# Altium schematic sheet Sheet_WallSwitch_TOP.SchDoc: Smart IoT Wallswitch
size A4; DrawnBy: Bc. Miroslav Kažimír; DocumentNumber: Wallswitch Top Module; SheetNumber: 1; SheetTotal: 1
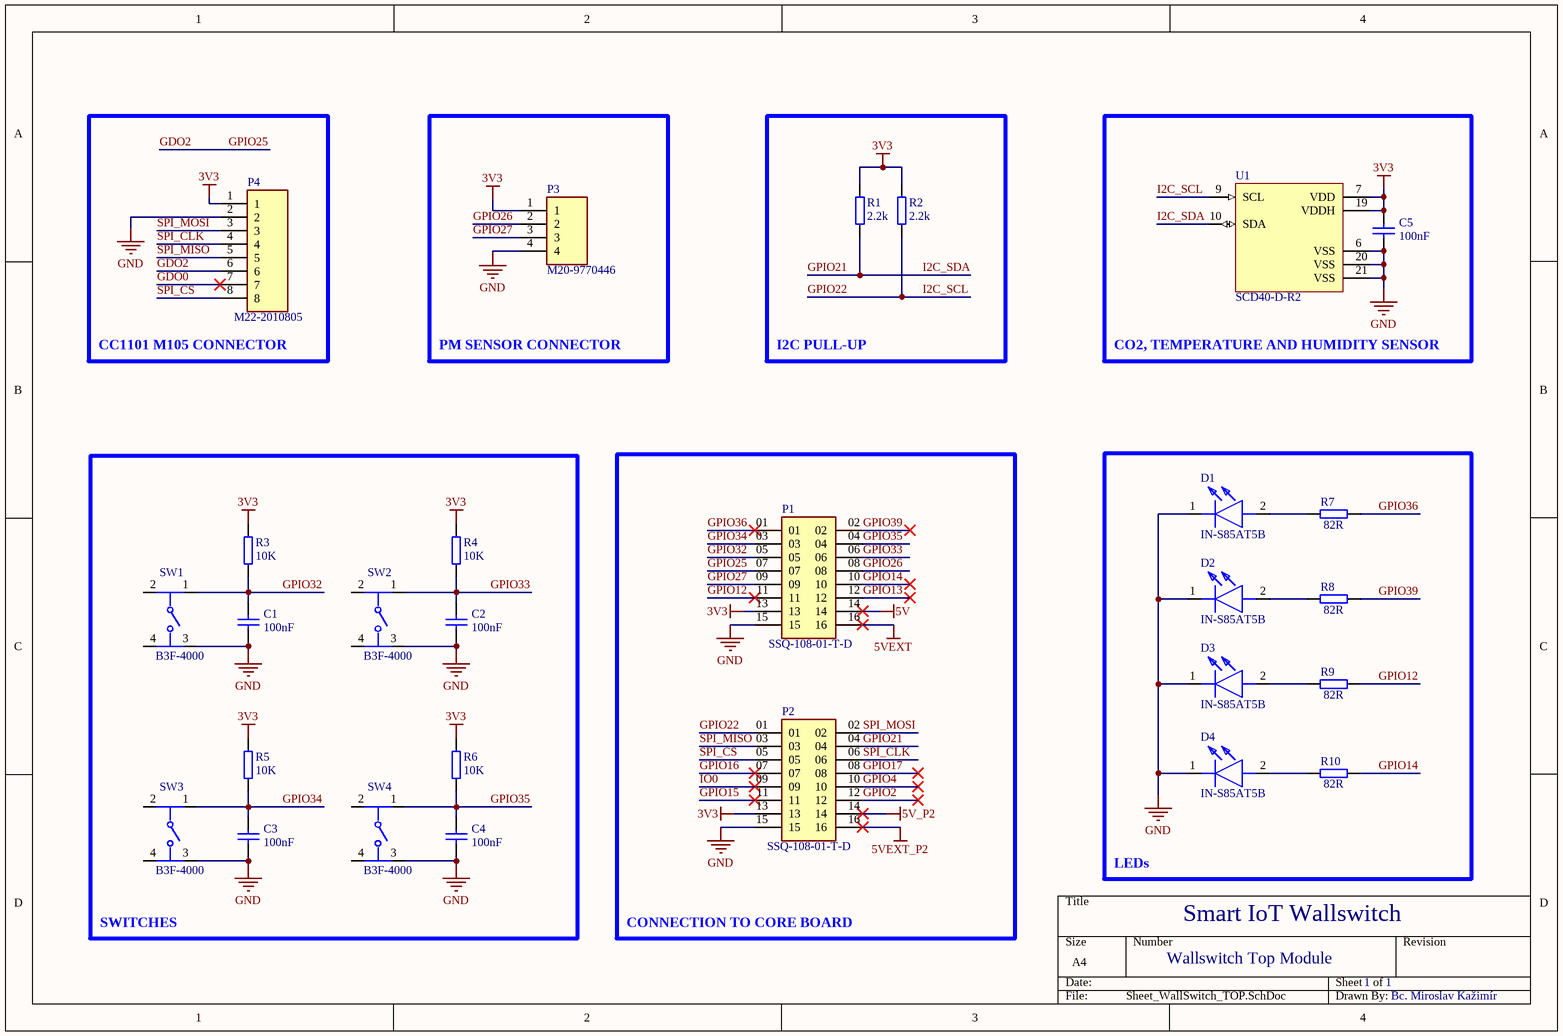
[diagram p0: Sheet_WallSwitch_TOP.SchDoc]

## Parts
C1  Capacitance: 100nF  [FP-C0805C-DN-IPC_A]  (hidden comment: C0805C104K5RAC7411)
C2  Capacitance: 100nF  [FP-C0805C-DN-IPC_A]  (hidden comment: C0805C104K5RAC7411)
C3  Capacitance: 100nF  [FP-C0805C-DN-IPC_A]  (hidden comment: C0805C104K5RAC7411)
C4  Capacitance: 100nF  [FP-C0805C-DN-IPC_A]  (hidden comment: C0805C104K5RAC7411)
C5  Capacitance: 100nF  [FP-C0805C-DN-IPC_A]  (hidden comment: C0805C104K5RAC7411)
D1  IN-S85AT5B  [LEDC2012X110N]
D2  IN-S85AT5B  [LEDC2012X110N]
D3  IN-S85AT5B  [LEDC2012X110N]
D4  IN-S85AT5B  [LEDC2012X110N]
P1  SSQ-108-01-T-D  [SAMTEC_SSQ-108-XX-X-D]
P2  SSQ-108-01-T-D  [SAMTEC_SSQ-108-XX-X-D]
P3  M20-9770446  [HDRV4W64P0X254_1X4_1016X254X834P]
P4  M22-2010805  [HDRV8W60P0X200_1X8_1600X200X525P]
R1  Resistance: 2.2k  [RCC1206_e3]  (hidden comment: RCC12062K20FKEA)
R2  Resistance: 2.2k  [RCC1206_e3]  (hidden comment: RCC12062K20FKEA)
R3  Resistance: 10K  [RESC2012X70N]  (hidden comment: ERJ-UP6J103V)
R4  Resistance: 10K  [RESC2012X70N]  (hidden comment: ERJ-UP6J103V)
R5  Resistance: 10K  [RESC2012X70N]  (hidden comment: ERJ-UP6J103V)
R6  Resistance: 10K  [RESC2012X70N]  (hidden comment: ERJ-UP6J103V)
R7  Resistance: 82R  [FP-ESR10-IPC_A]  (hidden comment: ESR10EZPJ820)
R8  Resistance: 82R  [FP-ESR10-IPC_A]  (hidden comment: ESR10EZPJ820)
R9  Resistance: 82R  [FP-ESR10-IPC_A]  (hidden comment: ESR10EZPJ820)
R10  Resistance: 82R  [FP-ESR10-IPC_A]  (hidden comment: ESR10EZPJ820)
SW1  B3F-4000  [FP-B3F-4000-MFG]
SW2  B3F-4000  [FP-B3F-4000-MFG]
SW3  B3F-4000  [FP-B3F-4000-MFG]
SW4  B3F-4000  [FP-B3F-4000-MFG]
U1  SCD40-D-R2  [SCD4x]

## Blocks framed on the sheet
CC1101 M105 CONNECTOR: P4
PM SENSOR CONNECTOR: P3
I2C PULL-UP: R1 R2
CO2, TEMPERATURE AND HUMIDITY SENSOR: C5 U1
SWITCHES: C1-C4 R3-R6 SW1-SW4
CONNECTION TO CORE BOARD: P1 P2
LEDs: D1-D4 R7-R10

## Nets
3V3: C5.1 P1.13 P2.13 P3.1 P4.1 R1.2 R2.2 R3.1 R4.1 R5.1 R6.1 U1.7(VDD) U1.19(VDDH)
5V: P1.14
5V_P2: P2.14
5VEXT: P1.16
5VEXT_P2: P2.16
GND: C1.2 C2.2 C3.2 C4.2 C5.2 D1.1(K) D2.1(K) D3.1(K) D4.1(K) P1.15 P2.15 P3.4 P4.2 SW1.3 SW2.3 SW3.3 SW4.3 U1.6(VSS) U1.20(VSS) U1.21(VSS)
GDO0: P4.7
GDO2: P1.07 P4.6  [also labelled GPIO25]
GPIO2: P2.12
GPIO4: P2.10
GPIO12: P1.11 R9.2
GPIO13: P1.12
GPIO14: P1.10 R10.2
GPIO15: P2.11
GPIO16: P2.07
GPIO17: P2.08
GPIO21: P2.04 R1.1 U1.10(SDA)  [also labelled I2C_SDA]
GPIO22: P2.01 R2.1 U1.9(SCL)  [also labelled I2C_SCL]
GPIO26: P1.08 P3.2
GPIO27: P1.09 P3.3
GPIO32: C1.1 P1.05 R3.2 SW1.1
GPIO33: C2.1 P1.06 R4.2 SW2.1
GPIO34: C3.1 P1.03 R5.2 SW3.1
GPIO35: C4.1 P1.04 R6.2 SW4.1
GPIO36: P1.01 R7.2
GPIO39: P1.02 R8.2
IO0: P2.09
SPI_CLK: P2.06 P4.4
SPI_CS: P2.05 P4.8
SPI_MISO: P2.03 P4.5
SPI_MOSI: P2.02 P4.3
NetD1_2: D1.2(A) R7.1
NetD2_2: D2.2(A) R8.1
NetD3_2: D3.2(A) R9.1
NetD4_2: D4.2(A) R10.1

Not connected (* = marked no-connect by the designer): SW1 2 4; SW2 2 4; SW3 2 4; SW4 2 4

## Library data of the parts
C1-C5 = C0805C104K5RAC7411: Cap Ceramic 0.1uF 50V X7R 10% SMD 0805 125°C Paper T/R; Manufacturer: KEMET; Supplier 1: Mouser; Manufacturer Part Number: C0805C104K5RAC7411; RoHS: Yes; Category: Ceramic Capacitors; Stock 1: 1484324; Pricing 1: 1=0,13000, 10=0,09300, 50=0,09300, 100=0,04400, 500=0,03100, 1000=0,02600, 2500=0,02400, 5000=0,02200, 10000=0,02100, 15000=0,02000 (USD); Mount: Surface Mount; Case/Package: 0805; Dielectric Material: Ceramic; Min Operating Temperature: -55°C; Max Operating Temperature: 125°C; Packaging: Tape and Reel; Tolerance: 10%; Dielectric: X7R; Voltage Rating (DC): 50V; Construction: Flat; Length: 2mm; Height: 0.9mm; Depth: 1.25mm; Radiation Hardening: No; RoHS Compliant: Yes; ComponentLink1URL: http://components.arrow.com/part/dataview/30748302S8994022N7429?src-supplier=Arrow+Electronics; ComponentLink1Description: http://components.arrow.com/part/dataview/30748302S8994022N7429?src-supplier=Arrow+Electronics; ComponentLink2URL: https://www.verical.com/server-webapp/html/getDatasheet?partID=248513&src-supplier=Verical; ComponentLink2Description: https://www.verical.com/server-webapp/html/getDatasheet?partID=248513&src-supplier=Verical; Supplier Part Number 1: 80-C0805C104K5RACLR
D1-D4 = IN-S85AT5B: Led Blue Clear 0805 SMD; Manufacturer: Inolux; Lens Style: Flat; Luminous Intensity: 80mcd; Forward Voltage: 3V; Test Current: 5mA; Viewing Angle: 120°; Dominant Wavelength: 470nm; Lens Size: 1.25mm; Supplier 1: Mouser; Manufacturer Part Number: IN-S85AT5B; RoHS: No; Category: LEDs; Stock 1: 32542; Pricing 1: 1=0,37000, 10=0,20100, 50=0,20100, 100=0,09300, 1000=0,06800, 10000=0,05100 (USD); Mount: Surface Mount; Case/Package: 0805; Color: Blue; Lens Color: Clear; Case Code (Imperial): 0805; Case Code (Metric): 2012; Packaging: Tape and Reel; Lens Transparency: Clear; Length: 2mm; Width: 1.25mm; Height: 1.1mm; ComponentLink1URL: http://www.inolux-corp.com/datasheet/SMDLED/Mono%20Color%20Top%20View/IN-S85AT%20Series_V1.0.pdf?src-supplier=Digi-Key; ComponentLink1Description: http://www.inolux-corp.com/datasheet/SMDLED/Mono%20Color%20Top%20View/IN-S85AT%20Series_V1.0.pdf?src-supplier=Digi-Key; Supplier Part Number 1: 743-IN-S85AT5B
P1 P2 = SSQ-108-01-T-D: Headers & Wire Housings Tiger Buy Socket Strip with Square Tails, 0.100 Pitch; Manufacturer: Samtec; Number of Contacts: 16; Gender: Female; Max Current Rating: 7.6A; Contact Resistance: 10mR; Connector Type: Receptacle; Max Voltage Rating (AC): 550V; Pitch: 2.54mm; Row Spacing: 0.1inch; Supplier 1: Mouser; Manufacturer Part Number: SSQ-108-01-T-D; RoHS: Yes; Category: Headers and Wire Housings; Stock 1: 1213; Pricing 1: 1=2,40000, 10=2,18000, 50=2,18000, 100=1,86000, 500=1,55000, 1000=1,33000, 2500=1,23000, 5000=1,18000, 10000=1,15000, 25000=1,12000 (USD); Mount: Through Hole; Contact Plating: Tin,Matte; Contact Material: Bronze; Color: Black; Housing Color: Black; Housing Material: Polymer; Min Operating Temperature: -55°C; Max Operating Temperature: 105°C; Number of Rows: 2; Termination: Solder; Packaging: Bulk; Number of Positions: 16; Orientation: Straight; Series: SSQ; Contact Type: Female Socket; Length: 20.83mm; Width: 4.95mm; Depth: 4.95mm; Lead Free: Lead Free; RoHS Compliant: Yes; ComponentLink1URL: https://datasheet.ciiva.com/748/ssq-1xx-xx-xxx-x-xx-xxx-xx-x-mkt-748536.pdf?src-supplier=Digi-Key; ComponentLink1Description: https://datasheet.ciiva.com/748/ssq-1xx-xx-xxx-x-xx-xxx-xx-x-mkt-748536.pdf?src-supplier=Digi-Key; Supplier Part Number 1: 200-SSQ10801TD
P3 = M20-9770446: 04 SIL VERT PIN HDR; Manufacturer: Harwin; Number of Contacts: 4; Gender: Male; Current Rating: 3A; Voltage Rating: 750V; Connector Type: Male Pin; Contact Resistance: 30mR; Pitch: 2.54mm; Supplier 1: Mouser; Manufacturer Part Number: M20-9770446; RoHS: Yes; Category: Headers and Wire Housings; Stock 1: 20888; Pricing 1: 1=0,20000, 10=0,15300, 50=0,15300, 100=0,12500, 500=0,11300, 1000=0,09100, 2000=0,08100, 10000=0,07300, 25000=0,06800, 50000=0,06600 (USD); Mount: Through Hole; Case/Package: SIL; Housing Color: Black; Contact Plating: Tin; Color: Black; Contact Material: Brass; Housing Material: Nylon; Min Operating Temperature: -40°C; Max Operating Temperature: 105°C; Termination: Solder; Number of Rows: 1; Orientation: Straight; Number of Positions: 4; Package Quantity: 1000; Packaging: Bulk; Max Current Rating: 3A; Length: 10.16mm; Contact Mating Length: 0.228inch; Depth: 2.54mm; ComponentLink1URL: https://datasheet.ciiva.com/6832/m20-977-6832936.pdf?src-supplier=Digi-Key; ComponentLink1Description: https://datasheet.ciiva.com/6832/m20-977-6832936.pdf?src-supplier=Digi-Key; Supplier Part Number 1: 855-M20-9770446
P4 = M22-2010805: Connector, Header, 8Pos, 1Row, 2Mm Rohs Compliant: Yes; Manufacturer: Harwin; Number of Contacts: 8; Max Current Rating: 1A; Contact Resistance: 20mR; Voltage Rating: 650V; Insulation Resistance: 10GR; Connector Type: Male Pin; Supplier 1: Mouser; Manufacturer Part Number: M22-2010805; RoHS: Yes; Category: Headers and Wire Housings; Stock 1: 686; Pricing 1: 1=0,57000, 10=0,44500, 50=0,44500, 100=0,38500, 1000=0,28800, 10000=0,23600 (USD); Mount: Through Hole; Case/Package: SIL; Contact Plating: Gold; Contact Material: Bronze; Color: Black; Housing Color: Black; Housing Material: Nylon; Min Operating Temperature: -55°C; Max Operating Temperature: 105°C; Number of Rows: 1; Termination: Solder; Current Rating: 1A; Package Quantity: 1000; Packaging: Bulk; Number of Positions: 8; Orientation: Straight; Series: M22; Contact Type: Male Pin; Length: 16mm; Pitch: 2mm; Contact Mating Length: 0.138inch; Depth: 2mm; Radiation Hardening: No; REACH SVHC: No SVHC; Flammability Rating: UL94 V-0; RoHS Compliant: Yes; ComponentLink1URL: https://datasheet.ciiva.com/11751/0900766b800345c0-11751285.pdf?src-supplier=RSComponents; ComponentLink1Description: https://datasheet.ciiva.com/11751/0900766b800345c0-11751285.pdf?src-supplier=RSComponents; ComponentLink2URL: https://datasheet.ciiva.com/9479/m22-201-9479493.pdf?src-supplier=Avnet; ComponentLink2Description: https://datasheet.ciiva.com/9479/m22-201-9479493.pdf?src-supplier=Avnet; ComponentLink3URL: https://datasheet.ciiva.com/6814/m22-201-6814953.pdf?src-supplier=Digi-Key; ComponentLink3Description: https://datasheet.ciiva.com/6814/m22-201-6814953.pdf?src-supplier=Digi-Key; Supplier Part Number 1: 855-M22-2010805
R1 R2 = RCC12062K20FKEA: Res, Aec-Q200, 2K2, 1%, 0.5W, 1206 Rohs Compliant: Yes; Manufacturer: Vishay; Supplier 1: Mouser; Manufacturer Part Number: RCC12062K20FKEA; RoHS: No; Category: Chip SMD Resistors; Stock 1: 10157; Pricing 1: 1=0,32000, 10=0,27600, 50=0,27600, 100=0,10800, 250=0,10700, 1000=0,04500, 5000=0,04300, 10000=0,04300 (USD); Supplier Part Number 1: 71-RCC12062K20FKEA
R3-R6 = ERJ-UP6J103V: Res 10K Ohm 5% 1/2W 0805; Manufacturer: Panasonic; Supplier 1: Mouser; Manufacturer Part Number: ERJ-UP6J103V; RoHS: No; Category: Chip SMD Resistors; Stock 1: 46150; Pricing 1: 1=0,16000, 10=0,11900, 50=0,11900, 100=0,05800, 1000=0,02500, 10000=0,02100 (USD); Supplier Part Number 1: 667-ERJ-UP6J103V
R7-R10 = ESR10EZPJ820: Res Thick Film 0805 82 Ohm 5% 0.4W ±200ppm/C Epoxy Resin Pad SMD Automotive T/R; Manufacturer: Rohm; Temperature Coefficient: 200ppm/°C; Power Rating: 250mW; Max Power Dissipation: 400mW; Supplier 1: Mouser; Manufacturer Part Number: ESR10EZPJ820; RoHS: Yes; Category: Chip SMD Resistors; Stock 1: 16946; Pricing 1: 1=0,10000, 10=0,08600, 50=0,08600, 100=0,03300, 1000=0,01500, 10000=0,01100 (USD); Case/Package: 0805; Case Code (Imperial): 0805; Case Code (Metric): 2012; Size Code: 0805; Tolerance: 5%; Features: Automotive AEC-Q200; Series: ESR; Packaging: Cut Tape; Number of Terminations: 2; Lead Free: Lead Free; RoHS Compliant: Yes; ComponentLink1URL: https://datasheet.ciiva.com/2468/esr-2468944.pdf?src-supplier=Digi-Key; ComponentLink1Description: https://datasheet.ciiva.com/2468/esr-2468944.pdf?src-supplier=Digi-Key; ComponentLink2URL: https://datasheet.ciiva.com/16439/esr10ezpd-16439950.pdf?src-supplier=Future+Electronics; ComponentLink2Description: https://datasheet.ciiva.com/16439/esr10ezpd-16439950.pdf?src-supplier=Future+Electronics; Supplier Part Number 1: 755-ESR10EZPJ820
SW1-SW4 = B3F-4000: SWITCH TACTILE SPST-NO 0.05A 24V; Manufacturer: Omron; Supplier 1: Mouser; Manufacturer Part Number: B3F-4000; RoHS: Yes; Category: Tactile Switches; Stock 1: 3308; Pricing 1: 1=0,54000, 10=0,52700, 50=0,50300, 100=0,43600, 1000=0,33000, 10000=0,32000 (USD); ComponentLink1URL: https://datasheet.ciiva.com/1634/611570-1634130.pdf?src-supplier=Farnell; ComponentLink1Description: https://datasheet.ciiva.com/1634/611570-1634130.pdf?src-supplier=Farnell; ComponentLink2URL: https://datasheet.ciiva.com/2900/b3f-0811-2900015.pdf?src-supplier=Digi-Key; ComponentLink2Description: https://datasheet.ciiva.com/2900/b3f-0811-2900015.pdf?src-supplier=Digi-Key; ComponentLink3URL: https://datasheet.ciiva.com/5283/b3f-0811-26083-5283451.pdf?src-supplier=Mouser; ComponentLink3Description: https://datasheet.ciiva.com/5283/b3f-0811-26083-5283451.pdf?src-supplier=Mouser; ComponentLink4URL: https://datasheet.ciiva.com/14142/b3f-eng-datasheet-14142463.pdf?src-supplier=Distrelec; ComponentLink4Description: https://datasheet.ciiva.com/14142/b3f-eng-datasheet-14142463.pdf?src-supplier=Distrelec; ComponentLink5URL: https://datasheet.ciiva.com/14540/70175371-14540890.pdf?src-supplier=Allied+Electronics; ComponentLink5Description: https://datasheet.ciiva.com/14540/70175371-14540890.pdf?src-supplier=Allied+Electronics; ComponentLink6URL: https://datasheet.ciiva.com/16154/en-b3f-16154927.pdf?src-supplier=Onlinecomponents.com; ComponentLink6Description: https://datasheet.ciiva.com/16154/en-b3f-16154927.pdf?src-supplier=Onlinecomponents.com; ComponentLink7URL: https://datasheet.ciiva.com/30093/en-b3f-30093919.pdf?src-supplier=Onlinecomponents.com; ComponentLink7Description: https://datasheet.ciiva.com/30093/en-b3f-30093919.pdf?src-supplier=Onlinecomponents.com; ComponentLink8URL: https://datasheet.ciiva.com/15183/getdatasheetpartid-388869-15183799.pdf?src-supplier=Verical; ComponentLink8Description: https://datasheet.ciiva.com/15183/getdatasheetpartid-388869-15183799.pdf?src-supplier=Verical; ComponentLink9URL: https://datasheet.ciiva.com/1532/en-b3f-1532558.pdf?src-supplier=Element14; ComponentLink9Description: https://datasheet.ciiva.com/1532/en-b3f-1532558.pdf?src-supplier=Element14; ComponentLink10URL: https://datasheet.ciiva.com/1532/1686088-1532559.pdf?src-supplier=Element14; ComponentLink10Description: https://datasheet.ciiva.com/1532/1686088-1532559.pdf?src-supplier=Element14; ComponentLink11URL: https://datasheet.ciiva.com/1532/611570-1532593.pdf?src-supplier=Element14; ComponentLink11Description: https://datasheet.ciiva.com/1532/611570-1532593.pdf?src-supplier=Element14; Supplier Part Number 1: 653-B3F-4000
U1 = SCD40-D-R2: SCD40-D-R2 CO2 Sensor I2C, SMD ToR 600 pcs; Manufacturer: Sensirion; Supplier 1: Mouser; Manufacturer Part Number: SCD40-D-R2; RoHS: Yes; Stock 1: 1625; Pricing 1: 1=38,78000, 10=33,50000, 50=27,33000, 100=26,45000, 1000=24,69000, 10000=24,69000 (USD); Supplier Part Number 1: 403-SCD40-D-R2